# EAGLE design fpc-30-lcd-ERM24064 (EAGLE 9.6.2)
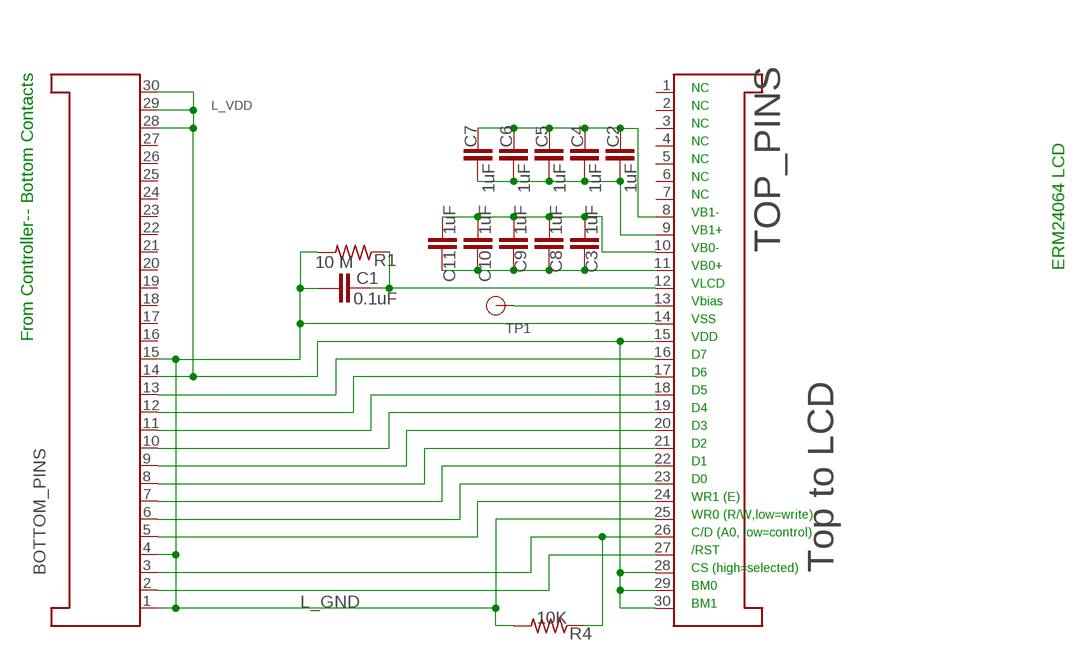
[diagram p0: schematic, sheet 1]

## Parts
BOTTOM_PINS  FPC30-bottom_pins  FPC_30-PINS  [FH12-30S-0.5SH]
C1  0.1uF  C-EUC0603K  [C0603K]
C2  1uF  C-EUC0603K  [C0603K]
C3  1uF  C-EUC0603K  [C0603K]
C4  1uF  C-EUC0603K  [C0603K]
C5  1uF  C-EUC0603K  [C0603K]
C6  1uF  C-EUC0603K  [C0603K]
C7  1uF  C-EUC0603K  [C0603K]
C8  1uF  C-EUC0603K  [C0603K]
C9  1uF  C-EUC0603K  [C0603K]
C10  1uF  C-EUC0603K  [C0603K]
C11  1uF  C-EUC0603K  [C0603K]
R1  10 M  R-US_R0603  [R0603]
R4  10K  R-US_R0603  [R0603]
TOP_PINS  Top to LCD  FPC_30-PINS  [FH12-30S-0.5SH]
TP1  TP-1  [TP]

## Nets
L-A0: BOTTOM_PINS.3 R4.1 TOP_PINS.26
L-D0: BOTTOM_PINS.6 TOP_PINS.23
L-D1: BOTTOM_PINS.7 TOP_PINS.22
L-D3: BOTTOM_PINS.9 TOP_PINS.20
L-D4: BOTTOM_PINS.10 TOP_PINS.19
L-D5: BOTTOM_PINS.11 TOP_PINS.18
L-D6: BOTTOM_PINS.12 TOP_PINS.17
L-RD/E: BOTTOM_PINS.5 TOP_PINS.24
L-RES: BOTTOM_PINS.2 TOP_PINS.27
L_D7: BOTTOM_PINS.13 TOP_PINS.16
L_GND: BOTTOM_PINS.1 BOTTOM_PINS.4 BOTTOM_PINS.15 C1.2 R1.2 R4.2 TOP_PINS.14 TOP_PINS.25
L_VDD: BOTTOM_PINS.14 BOTTOM_PINS.28 BOTTOM_PINS.29 BOTTOM_PINS.30 TOP_PINS.15 TOP_PINS.28 TOP_PINS.29 TOP_PINS.30
N$1: C1.1 R1.1 TOP_PINS.12
N$2: TOP_PINS.13 TP1.P$1
N$4: C2.1 C4.1 C5.1 C6.1 C7.1 TOP_PINS.8
N$5: C3.2 C8.2 C9.2 C10.2 C11.2 TOP_PINS.10
N$6: C2.2 C4.2 C5.2 C6.2 C7.2 TOP_PINS.9
N$7: C3.1 C8.1 C9.1 C10.1 C11.1 TOP_PINS.11
N$13: BOTTOM_PINS.8 TOP_PINS.21
Unconnected: BOTTOM_PINS.16 BOTTOM_PINS.17 BOTTOM_PINS.18 BOTTOM_PINS.19 BOTTOM_PINS.20 BOTTOM_PINS.21 BOTTOM_PINS.22 BOTTOM_PINS.23 BOTTOM_PINS.24 BOTTOM_PINS.25 BOTTOM_PINS.26 BOTTOM_PINS.27 TOP_PINS.1 TOP_PINS.2 TOP_PINS.3 TOP_PINS.4 TOP_PINS.5 TOP_PINS.6 TOP_PINS.7

## Notes on the sheet
- NC
- NC
- NC
- NC
- NC
- NC
- NC
- VB1-
- VB1+
- VB0-
- VB0+ | ERM24064 LCD
- VLCD
- Vbias
- VSS
- From Controller-- Bottom Contacts | VDD
- D7
- D6
- D5
- D4
- D3
- D2
- D1
- D0
- WR1 (E)
- WR0 (R/W,low=write)
- C/D (A0, low=control)
- /RST
- CS (high=selected)
- BM0
- BM1

## Library data of the parts
BOTTOM_PINS = XP9300:FPC_30-PINS; DIGIKEY: 732-3517-ND
C1-C11 = rcl:C-EU: CAPACITOR, European symbol; SPICEPREFIX: C
R1 R4 = rcl:R-US_: RESISTOR, American symbol; SPICEPREFIX: R
TOP_PINS = XP9300:FPC_30-PINS
TP1 = XP9300:TP-1

## Board
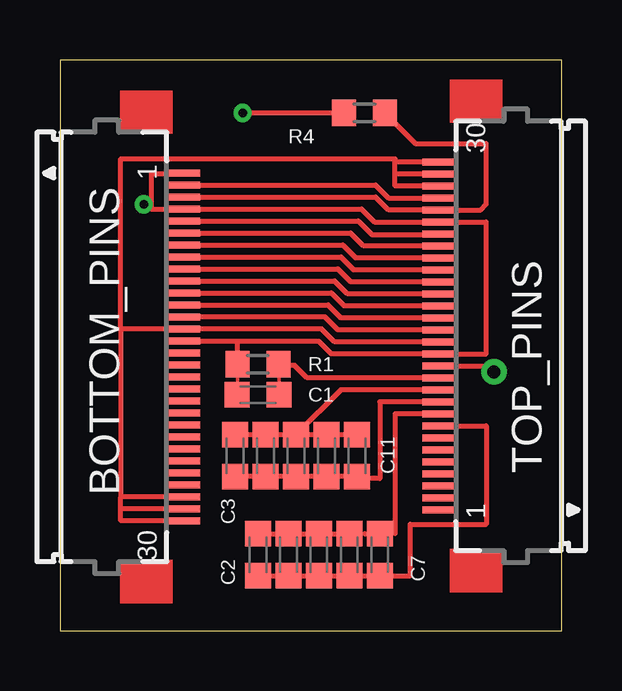
[diagram p1: board, top side]
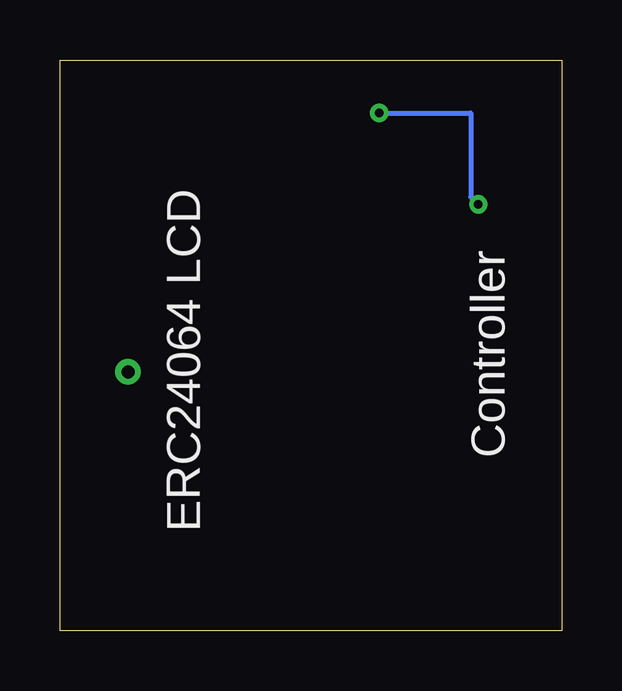
[diagram p2: board, bottom side, seen from below]

Size 20.94 x 23.8 mm. Coordinates in mm from the lower left corner, seen from the top.
Outline: 0,0 20.94,0 20.94,23.8 0,23.8 0,0
Copper layers (1*16): Top 0.035mm / dielectric 1.5mm / Bottom 0.035mm
Design rules "default": minimum track width 6mil, minimum drill 0.35mm, track to track 6mil, track to pad 6mil, pad to pad 6mil, via to via 6mil, smd to smd 6mil, copper to edge 40mil, drill to drill 6mil, minimum pad ring 10mil, minimum via ring 8mil, stop-mask expansion 4mil, vias tented up to drill 0mil, thermal gap 10mil

### Footprints (pad centres in the part's own frame; a part is rotated, then mirrored left to right if it is on the bottom)
FH12-30S-0.5SH = smd 0.3 x 1.3: 1 -7.02,2.66; 2 -6.52,2.66; 3 -6.02,2.66; 4 -5.52,2.66; 5 -5.02,2.66; 6 -4.52,2.66; 7 -4.02,2.66; 8 -3.52,2.66; 9 -3.02,2.66; 10 -2.52,2.66; 11 -2.02,2.66; 12 -1.52,2.66; 13 -1.02,2.66; 14 -0.52,2.66; 15 -0.02,2.66; 16 0.48,2.66; 17 0.98,2.66; 18 1.48,2.66; 19 1.98,2.66; 20 2.48,2.66; 21 2.98,2.66; 22 3.48,2.66; 23 3.98,2.66; 24 4.48,2.66; 25 4.98,2.66; 26 5.48,2.66; 27 5.98,2.66; 28 6.48,2.66; 29 6.98,2.66; 30 7.48,2.66
C0603K = smd 1.05 x 1.08: 1 -0.875,0; 2 0.875,0
R0603 = smd 1 x 1.1: 1 -0.85,0; 2 0.85,0
TP = drill 0.55: P$1 0,0

### Placement (x,y rotation side)
BOTTOM_PINS  2.54,12.06 270 top
C1  8.25,9.84 180 top
C2  8.25,3.17 90 top
C3  7.3,7.3 270 top
C4  9.53,3.17 90 top
C5  10.79,3.17 90 top
C6  12.06,3.17 90 top
C7  13.33,3.17 90 top
C8  8.57,7.3 270 top
C9  9.84,7.3 270 top
C10  11.11,7.3 270 top
C11  12.38,7.3 270 top
R1  8.25,11.11 180 top
R4  12.7,21.59 180 top
TOP_PINS  18.42,12.06 90 top
TP1  18.1,10.79 0 top

### Tracks (layer width: path | path; a pad name or v marks a point on that pad's centre or on a via)
L-A0
  Top 0.203: BOTTOM_PINS.3 13.16,18.08 13.7,17.54 TOP_PINS.26 17.55,17.54 17.78,17.78 17.78,20.32 14.82,20.32 R4.1
L-D0
  Top 0.203: BOTTOM_PINS.6 12.12,16.58 12.66,16.04 TOP_PINS.23
L-D1
  Top 0.203: TOP_PINS.22 12.34,15.54 11.8,16.08 BOTTOM_PINS.7
L-D3
  Top 0.203: TOP_PINS.20 12.12,14.54 11.58,15.09 BOTTOM_PINS.9
L-D4
  Top 0.203: TOP_PINS.19 11.99,14.04 11.45,14.59 BOTTOM_PINS.10
L-D5
  Top 0.203: TOP_PINS.18 11.85,13.54 11.31,14.09 BOTTOM_PINS.11
L-D6
  Top 0.203: TOP_PINS.17 11.72,13.04 11.18,13.59 BOTTOM_PINS.12
L-RD/E
  Top 0.203: BOTTOM_PINS.5 12.44,17.08 13.02,16.51 15.72,16.51 TOP_PINS.24
L-RES
  Top 0.203: BOTTOM_PINS.2 13.17,18.58 13.71,18.04 TOP_PINS.27
L_D7
  Top 0.203: TOP_PINS.16 11.58,12.54 11.04,13.09 BOTTOM_PINS.13
L_GND  (via drill 0.35)
  Top 0.152: C1.2 7.4,9.87 R1.2
  Top 0.203: BOTTOM_PINS.15 5.18,12.06 7.4,12.06 | 7.4,12.06 10.79,12.06 11.31,11.54 TOP_PINS.14 17.78,11.54 17.78,17.04 TOP_PINS.25 13.12,17.04 12.58,17.58 BOTTOM_PINS.4 3.81,17.58 3.81,17.78 | BOTTOM_PINS.1 5.16,19.05 3.81,19.05 3.81,17.78 | 7.4,12.06 R1.2 7.3,11.01 | v3.49,17.78 3.81,17.78 | R4.2 v7.62,21.59
  Bottom 0.203: v7.62,21.59 3.81,21.59 3.81,18.1 v3.49,17.78
L_VDD
  Top 0.203: TOP_PINS.15 11.45,12.04 10.91,12.59 BOTTOM_PINS.14 2.54,12.59 | BOTTOM_PINS.30 2.54,4.58 2.54,5.08 | 2.54,5.08 2.54,5.58 | 2.54,12.59 2.54,5.58 | BOTTOM_PINS.29 2.54,5.08 | BOTTOM_PINS.28 2.54,5.58 | 2.54,12.59 2.54,19.68 13.97,19.68 13.97,19.54 | TOP_PINS.28 13.97,18.54 13.97,19.04 | 13.97,19.04 13.97,19.54 | TOP_PINS.30 13.97,19.54 | TOP_PINS.29 13.97,19.04
N$1
  Top 0.152: R1.1 9.13,11.09 C1.1
  Top 0.203: TOP_PINS.12 10.31,10.54 9.79,11.06 9.16,11.06 R1.1
N$2
  Top 0.203: TOP_PINS.13 18.1,11.04 TP1.P$1
N$4
  Top 0.203: C2.1 C4.1 C5.1 C6.1 C7.1 14.6,2.3 14.6,4.45 17.78,4.45 17.78,8.54 TOP_PINS.8
N$5
  Top 0.152: 12.38,6.35 C11.2
  Top 0.203: TOP_PINS.10 13.33,9.54 13.33,6.35 12.38,6.35 | C11.2 C10.2 C9.2 C8.2 C3.2
N$6
  Top 0.152: C6.2 12.7,4.05 | 13.97,4.05 C7.2
  Top 0.203: TOP_PINS.9 13.97,9.04 13.97,4.05 | C2.2 C4.2 C5.2 C6.2 | 12.7,4.05 C7.2
N$7
  Top 0.203: C3.1 C8.1 C9.1 | C9.1 C10.1 C11.1 | TOP_PINS.11 11.71,10.04 C9.1
N$13
  Top 0.203: TOP_PINS.21 12.26,15.04 11.72,15.58 BOTTOM_PINS.8

### Text on the board
bPlace: ERC24064 LCD | Controller